# Altium schematic sheet CAN.SchDoc
size A2
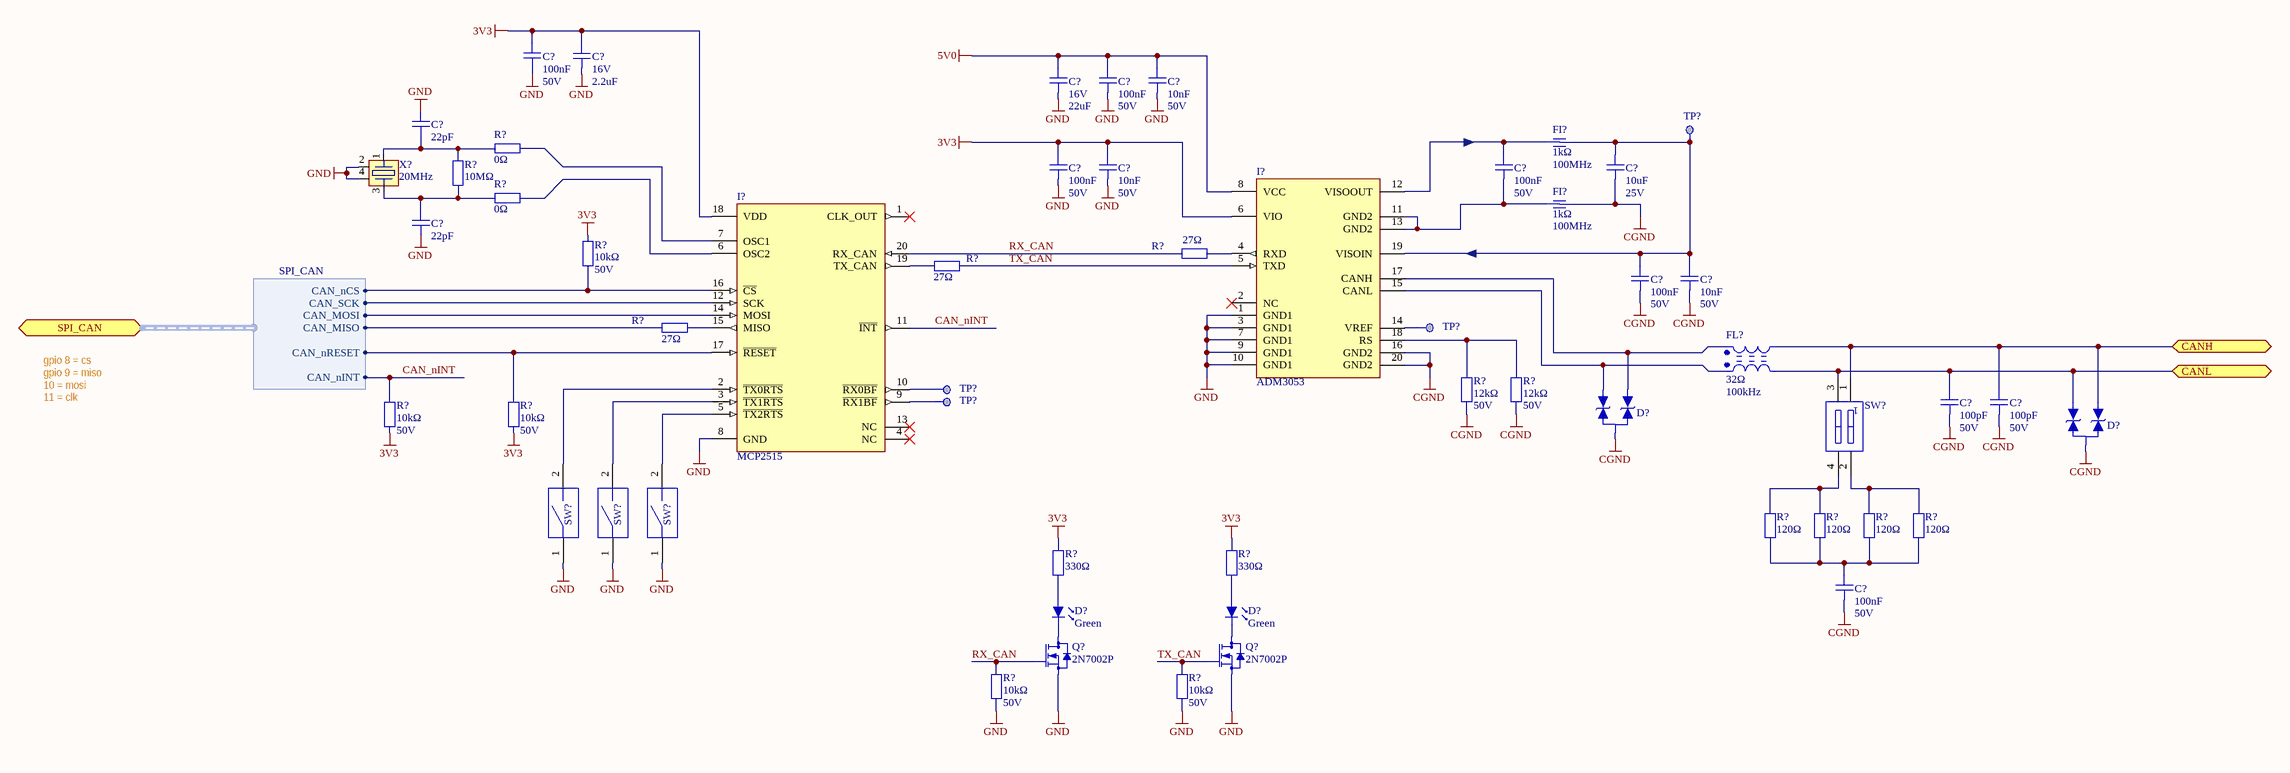
[diagram p0: CAN.SchDoc]

## Parts
(Parts that share a designator on the sheet are numbered #1, #2 ... from top to bottom, then left to right.)
C?#1  Voltage: 50V  [C0603M_1709282117]  (hidden comment: 100nF)
C?#2  Value2: 16V  [C0603M_1709282117]  (hidden comment: 2.2uF)
C?#3  Value2: 16V  [C0805M_1708282121]  (hidden comment: 22uF)
C?#4  Voltage: 50V  [C0603M_1709282117]  (hidden comment: 100nF)
C?#5  Voltage: 50V  [C0603M_1709282117]  (hidden comment: 10nF)
C?#6  22pF  [C0603M_1709282117]
C?#7  Voltage: 50V  [C0603M_1709282117]  (hidden comment: 100nF)
C?#8  Voltage: 50V  [C0603M_1709282117]  (hidden comment: 10nF)
C?#9  Voltage: 50V  [C0603M_1709282117]  (hidden comment: 100nF)
C?#10  Voltage: 25V  [C0603M_1709282117]  (hidden comment: 10uF)
C?#11  22pF  [C0603M_1709282117]
C?#12  Voltage: 50V  [C0603M_1709282117]  (hidden comment: 100nF)
C?#13  Voltage: 50V  [C0603M_1709282117]  (hidden comment: 10nF)
C?#14  Voltage: 50V  [C0603M_1709282117]  (hidden comment: 100pF)
C?#15  Voltage: 50V  [C0603M_1709282117]  (hidden comment: 100pF)
C?#16  Voltage: 50V  [C0603M_1709282117]  (hidden comment: 100nF)
D?#1  (no value)
D?#2  (no value)
D?#3  Color: Green  [LED_SML-D12x8_1709122228]  (hidden comment: SML-D12P8WT86C)
D?#4  Color: Green  [LED_SML-D12x8_1709122228]  (hidden comment: SML-D12P8WT86C)
FI?#1  Frequency: 100MHz  [L1206M_1708232326]  (hidden comment: 1kΩ)
FI?#2  Frequency: 100MHz  [L1206M_1708232326]  (hidden comment: 1kΩ)
FL?  Frequency: 100kHz  [CMDR331M_1709290000]  (hidden comment: 32Ω)
I?#1  ADM3053  [SO20_W_1709182243]
I?#2  MCP2515  [QFN20_1706282325]
Q?#1  2N7002P  [SOT23_1709070018]
Q?#2  2N7002P  [SOT23_1709070018]
R?#1  0Ω  [R0603M_RESC1608X06N]
R?#2  10MΩ  [R0603M_RESC1608X06N]
R?#3  0Ω  [R0603M_RESC1608X06N]
R?#4  Voltage: 50V  [R0603M_RESC1608X06N]  (hidden comment: 10kΩ)
R?#5  27Ω  [R0603M_RESC1608X06N]
R?#6  27Ω  [R0603M_RESC1608X06N]
R?#7  27Ω  [R0603M_RESC1608X06N]
R?#8  Voltage: 50V  [R0603M_RESC1608X06N]  (hidden comment: 12kΩ)
R?#9  Voltage: 50V  [R0603M_RESC1608X06N]  (hidden comment: 12kΩ)
R?#10  Voltage: 50V  [R0603M_RESC1608X06N]  (hidden comment: 10kΩ)
R?#11  Voltage: 50V  [R0603M_RESC1608X06N]  (hidden comment: 10kΩ)
R?#12  120Ω  [R0805M_RESC2012X06N]
R?#13  120Ω  [R0805M_RESC2012X06N]
R?#14  120Ω  [R0805M_RESC2012X06N]
R?#15  120Ω  [R0805M_RESC2012X06N]
R?#16  330Ω  [R0603M_RESC1608X06N]
R?#17  330Ω  [R0603M_RESC1608X06N]
R?#18  Voltage: 50V  [R0603M_RESC1608X06N]  (hidden comment: 10kΩ)
R?#19  Voltage: 50V  [R0603M_RESC1608X06N]  (hidden comment: 10kΩ)
SW?#1  (no value)  [DIP1_OMORN_A6S-2104-H_1709272345]
SW?#2  (no value)  [TACT_2.5x3_OMRON_B3U-1000P]
SW?#3  (no value)  [TACT_2.5x3_OMRON_B3U-1000P]
SW?#4  (no value)  [TACT_2.5x3_OMRON_B3U-1000P]
TP?#1  (no value)  [TESTPAD_1MM_ROUND]
TP?#2  (no value)  [TESTPAD_1MM_ROUND]
TP?#3  (no value)  [TESTPAD_1MM_ROUND]
TP?#4  (no value)  [TESTPAD_1MM_ROUND]
X?  Frequency: 20MHz  [crystal_4p_5x3.2_1709260017]

## Ports
CANH, CANL, SPI_CAN (harness SPI_CAN)

## Harnesses
SPI_CAN: CAN_nCS, CAN_SCK, CAN_MOSI, CAN_MISO, CAN_nRESET, CAN_nINT

## Nets
3V3: C?#1.1 C?#2.2 C?#7.2 C?#8.2 I?#1.6(VIO) I?#2.18(VDD) R?#4.2 R?#10.2 R?#11.2 R?#16.1 R?#17.1
5V0: C?#3.2 C?#4.2 C?#5.2 I?#1.8(VCC)
CGND: C?#10.1 C?#12.1 C?#13.1 C?#14.1 C?#15.1 C?#16.1 D?#1.3 D?#2.3 FI?#2.2 I?#1.16(GND2) I?#1.20(GND2) R?#8.1 R?#9.1
GND: C?#1.2 C?#2.1 C?#3.1 C?#4.1 C?#5.1 C?#6.2 C?#7.1 C?#8.1 C?#11.1 I?#1.1(GND1) I?#1.3(GND1) I?#1.7(GND1) I?#1.9(GND1) I?#1.10(GND1) I?#2.8(GND) Q?#1.3(D) Q?#2.3(D) R?#18.1 R?#19.1 SW?#2.1 SW?#3.1 SW?#4.1 X?.2 X?.4
CAN_nINT: I?#2.11(~{INT}) R?#10.1 ; port SPI_CAN.CAN_nINT
CANH: C?#15.2 D?#2.1 FL?.4 SW?#1.1 ; port CANH
CANL: C?#14.2 D?#2.2 FL?.3 SW?#1.3 ; port CANL
RX_CAN: I?#2.20(RX_CAN) Q?#1.1(G) R?#5.1 R?#18.2
TX_CAN: I?#1.5(TXD) Q?#2.1(G) R?#6.2 R?#19.2
NetC?#6_1: C?#6.1 R?#1.1 R?#2.2 X?.1
NetC?#9_1: C?#9.1 FI?#2.1 I?#1.11(GND2) I?#1.13(GND2)
NetC?#9_2: C?#9.2 FI?#1.1 I?#1.12(VISOOUT)
NetC?#10_2: C?#10.2 C?#12.2 C?#13.2 FI?#1.2 I?#1.19(VISOIN) TP?#1.1
NetC?#11_2: C?#11.2 R?#2.1 R?#3.1 X?.3
NetC?#16_2: C?#16.2 R?#12.1 R?#13.1 R?#14.1 R?#15.1
NetD?#1_1: D?#1.1 FL?.1 I?#1.17(CANH)
NetD?#1_2: D?#1.2 FL?.2 I?#1.15(CANL)
NetD?#3_1: D?#3.1(Cathode) Q?#1.2(S)
NetD?#3_2: D?#3.2(Anode) R?#16.2
NetD?#4_1: D?#4.1(Cathode) Q?#2.2(S)
NetD?#4_2: D?#4.2(Anode) R?#17.2
NetI?#1_4: I?#1.4(RXD) R?#5.2
NetI?#1_14: I?#1.14(VREF) TP?#2.1
NetI?#1_18: I?#1.18(RS) R?#8.2 R?#9.2
NetI?#2_2: I?#2.2(~{TX0RTS}) SW?#2.2
NetI?#2_3: I?#2.3(~{TX1RTS}) SW?#3.2
NetI?#2_5: I?#2.5(~{TX2RTS}) SW?#4.2
NetI?#2_6: I?#2.6(OSC2) R?#3.2
NetI?#2_7: I?#2.7(OSC1) R?#1.2
NetI?#2_9: I?#2.9(~{RX1BF}) TP?#4.1
NetI?#2_10: I?#2.10(~{RX0BF}) TP?#3.1
NetI?#2_12: I?#2.12(SCK) ; port SPI_CAN.CAN_SCK
NetI?#2_14: I?#2.14(MOSI) ; port SPI_CAN.CAN_MOSI
NetI?#2_15: I?#2.15(MISO) R?#7.2
NetI?#2_16: I?#2.16(~{CS}) R?#4.1 ; port SPI_CAN.CAN_nCS
NetI?#2_17: I?#2.17(~{RESET}) R?#11.1 ; port SPI_CAN.CAN_nRESET
NetI?#2_19: I?#2.19(TX_CAN) R?#6.1
NetR?#7_1: R?#7.1 ; port SPI_CAN.CAN_MISO
NetR?#12_2: R?#12.2 R?#13.2 SW?#1.4
NetR?#14_2: R?#14.2 R?#15.2 SW?#1.2

Not connected (* = marked no-connect by the designer): I?#1 2(NC)*; I?#2 1(CLK_OUT)* 4(NC)* 13(NC)*

## Notes on the sheet
- gpio 8 = cs
  gpio 9 = miso
  10 = mosi
  11 = clk
- Title
- Size:
- Date:
- A3
- Number:
- Time:
- Revision:
- Sheet
- of
- File:

## Library data of the parts
C?#1 C?#4 C?#7 C?#9 C?#12 C?#16 = 010103-0061: C# CER  100nF 10% 50V X7R 0603; TempRange: -55/125°C; PartNumber: 010103-0061; Value: 100nF; Tolerance: 10%; Package: 0603; Dielectric: X7R; Type: CER
C?#2 = 010103-0074: C# CER  2.2uF 20% 16V X7R 0603; TempRange: -55/125°C; PartNumber: 010103-0074; Value: 2.2uF; Voltage: 16V; Tolerance: 20%; Package: 0603; Dielectric: X7R; Type: CER
C?#3 = 010103-0102: C# CER  22uF 10% 16V X5R 0805; TempRange: -55/85°C; PartNumber: 010103-0102; Value: 22uF; Voltage: 16V; Tolerance: 10%; Package: 0805; Dielectric: X5R; Type: CER
C?#5 C?#8 C?#13 = 010103-0049: C# CER  10nF 10% 50V X7R 0603; TempRange: -55/125°C; PartNumber: 010103-0049; Value: 10nF; Tolerance: 10%; Package: 0603; Dielectric: X7R; Type: CER
C?#6 C?#11 = 010103-0129: C# CER  22pF 5% 50V NP0 0603; TempRange: -55/125°C; PartNumber: 010103-0129; Value: 22pF; Voltage: 50V; Tolerance: 5%; Package: 0603; Dielectric: NP0; Type: CER
C?#10 = 010103-0083: C# CER  10uF 20% 25V X5R 0603; TempRange: -55/85°C; PartNumber: 010103-0083; Value: 10uF; Tolerance: 20%; Package: 0603; Dielectric: X5R; Type: CER
C?#14 C?#15 = 010103-0139: C# CER  100pF 5% 50V NP0 0603; TempRange: -55/125°C; PartNumber: 010103-0139; Value: 100pF; Tolerance: 5%; Package: 0603; Dielectric: NP0; Type: CER
D?#1 D?#2 = tvs_can: =Description
D?#3 D?#4 = 050101-0002: D# LED Green0,0540mcd @ 20mASML-D12P8WT86C-40/80°C 0603 AEC-Q101; Power: 50mW; PartNumber: 050101-0002; Value: SML-D12P8WT86C; Value2: Green; Features: AEC-Q101; LuminousIntensity: 40mcd @ 20mA; Package: 0603; TempRange: -40/80°C; Type: LED
FI?#1 FI?#2 = 010501-0029: FI# BEAD  1kΩ @  100MHz 25%  1A  300mΩdc 1206; TempRange: -55/125°C; PartNumber: 010501-0029; Value: 1kΩ; Value2: 100MHz; DCValue: 300mΩdc; Current: 1A; Tolerance: 25%; Package: 1206; Type: BEAD
FL? = 010502-0036: FL# CM FL  32Ω @  100kHz 25%  500mA  300mΩdc; TempRange: -40/135°C; PartNumber: 010502-0036; Value: 32Ω; Value2: 100kHz; DCValue: 300mΩdc; Current: 500mA; Tolerance: 25%; Type: CM FL
I?#1 = 040701-0003: I# CAN Isolated with DCDCADM3053SO20-W; TempRange: -40/85°C; PartNumber: 040701-0003; Value: ADM3053; Info: Isolated with DCDC; Package: SO20-W
I?#2 = 040701-0002: I# CAN CAN2.0B controllerMCP2515QFN20; TempRange: -40/85°C; PartNumber: 040701-0002; Value: MCP2515; Info: CAN2.0B controller; Package: QFN20
Q?#1 Q?#2 = 020201-0002: Q# SINGLE 12N7002P  350mA 60V 350mW SOT23; Rdson: 1,6Ω; VgsTh: 1,75V; TempRange: -55/150°C; MosfetType: N; PartNumber: 020201-0002; Value: 2N7002P; Current: 350mA; Vds: 60V; Power: 350mW; Package: SOT23; Type: SINGLE
R?#1 R?#3 = 010201-0001: R# FIX 0Ω 1% 100mW 0603; Voltage: 50V; TempRange: -55/155°C; PartNumber: 010201-0001; Value: 0Ω; Tolerance: 1%; Package: 0603; Power: 100mW; Type: FIX
R?#2 = 010201-0074: R# FIX  10MΩ 1% 100mW 0603; Voltage: 50V; TempRange: -55/155°C; PartNumber: 010201-0074; Value: 10MΩ; Tolerance: 1%; Package: 0603; Power: 100mW; Type: FIX
R?#4 R?#10 R?#11 R?#18 R?#19 = 010201-0038: R# FIX  10kΩ 1% 100mW 0603; TempRange: -55/155°C; PartNumber: 010201-0038; Value: 10kΩ; Tolerance: 1%; Power: 100mW; Package: 0603; Type: FIX
R?#5-R?#7 = 010201-0007: R# FIX  27Ω 1% 100mW 0603; Voltage: 50V; TempRange: -55/155°C; PartNumber: 010201-0007; Value: 27Ω; Tolerance: 1%; Package: 0603; Power: 100mW; Type: FIX
R?#8 R?#9 = 010201-0039: R# FIX  12kΩ 1% 100mW 0603; TempRange: -55/155°C; PartNumber: 010201-0039; Value: 12kΩ; Tolerance: 1%; Power: 100mW; Package: 0603; Type: FIX
R?#12-R?#15 = 010201-0089: R# FIX  120Ω 1% 125mW 0805; Voltage: 50V; TempRange: -55/155°C; PartNumber: 010201-0089; Value: 120Ω; Tolerance: 1%; Package: 0805; Power: 125mW; Type: FIX
R?#16 R?#17 = 010201-0020: R# FIX  330Ω 1% 100mW 0603; Voltage: 50V; TempRange: -55/155°C; PartNumber: 010201-0020; Value: 330Ω; Tolerance: 1%; Package: 0603; Power: 100mW; Type: FIX
SW?#1 = 080101-0004: S# DIP 20,0224Omron A6S-2104-H; ContactVoltageDC: 24Vdc; ContactCurrent: 20mA; Poles: 2p; PartNumber: 080101-0004; Article: Omron A6S-2104-H; Type: DIP
SW?#2-SW?#4 = 080103-0003: S# PUSH 50mA 12Vdc Omron B3U-1000P; PartNumber: 080103-0003; ContactVoltageDC: 12Vdc; ContactCurrent: 50mA
TP?#1-TP?#4 = 100101-0001: TP# TEST PAD ROUND 1mm; PartNumber: 100101-0001; Info: PAD ROUND 1mm
X? = 010401-0003: X# XTAL  20MHz 50ppm 5x3.2mm -10/60°C; LoadCapacitance: 18pF; ShuntCapacitance: 7pF; EqSeriesResistance: 50; StabilityAge: 5ppm; DriveLevel: 10uW; PartNumber: 010401-0003; Tolerance: 50ppm; Dimension: 5x3.2mm; TempRange: -10/60°C; Type: XTAL; StabilityTemp: 50ppm